# EAGLE design untitled (EAGLE 9.6.2)
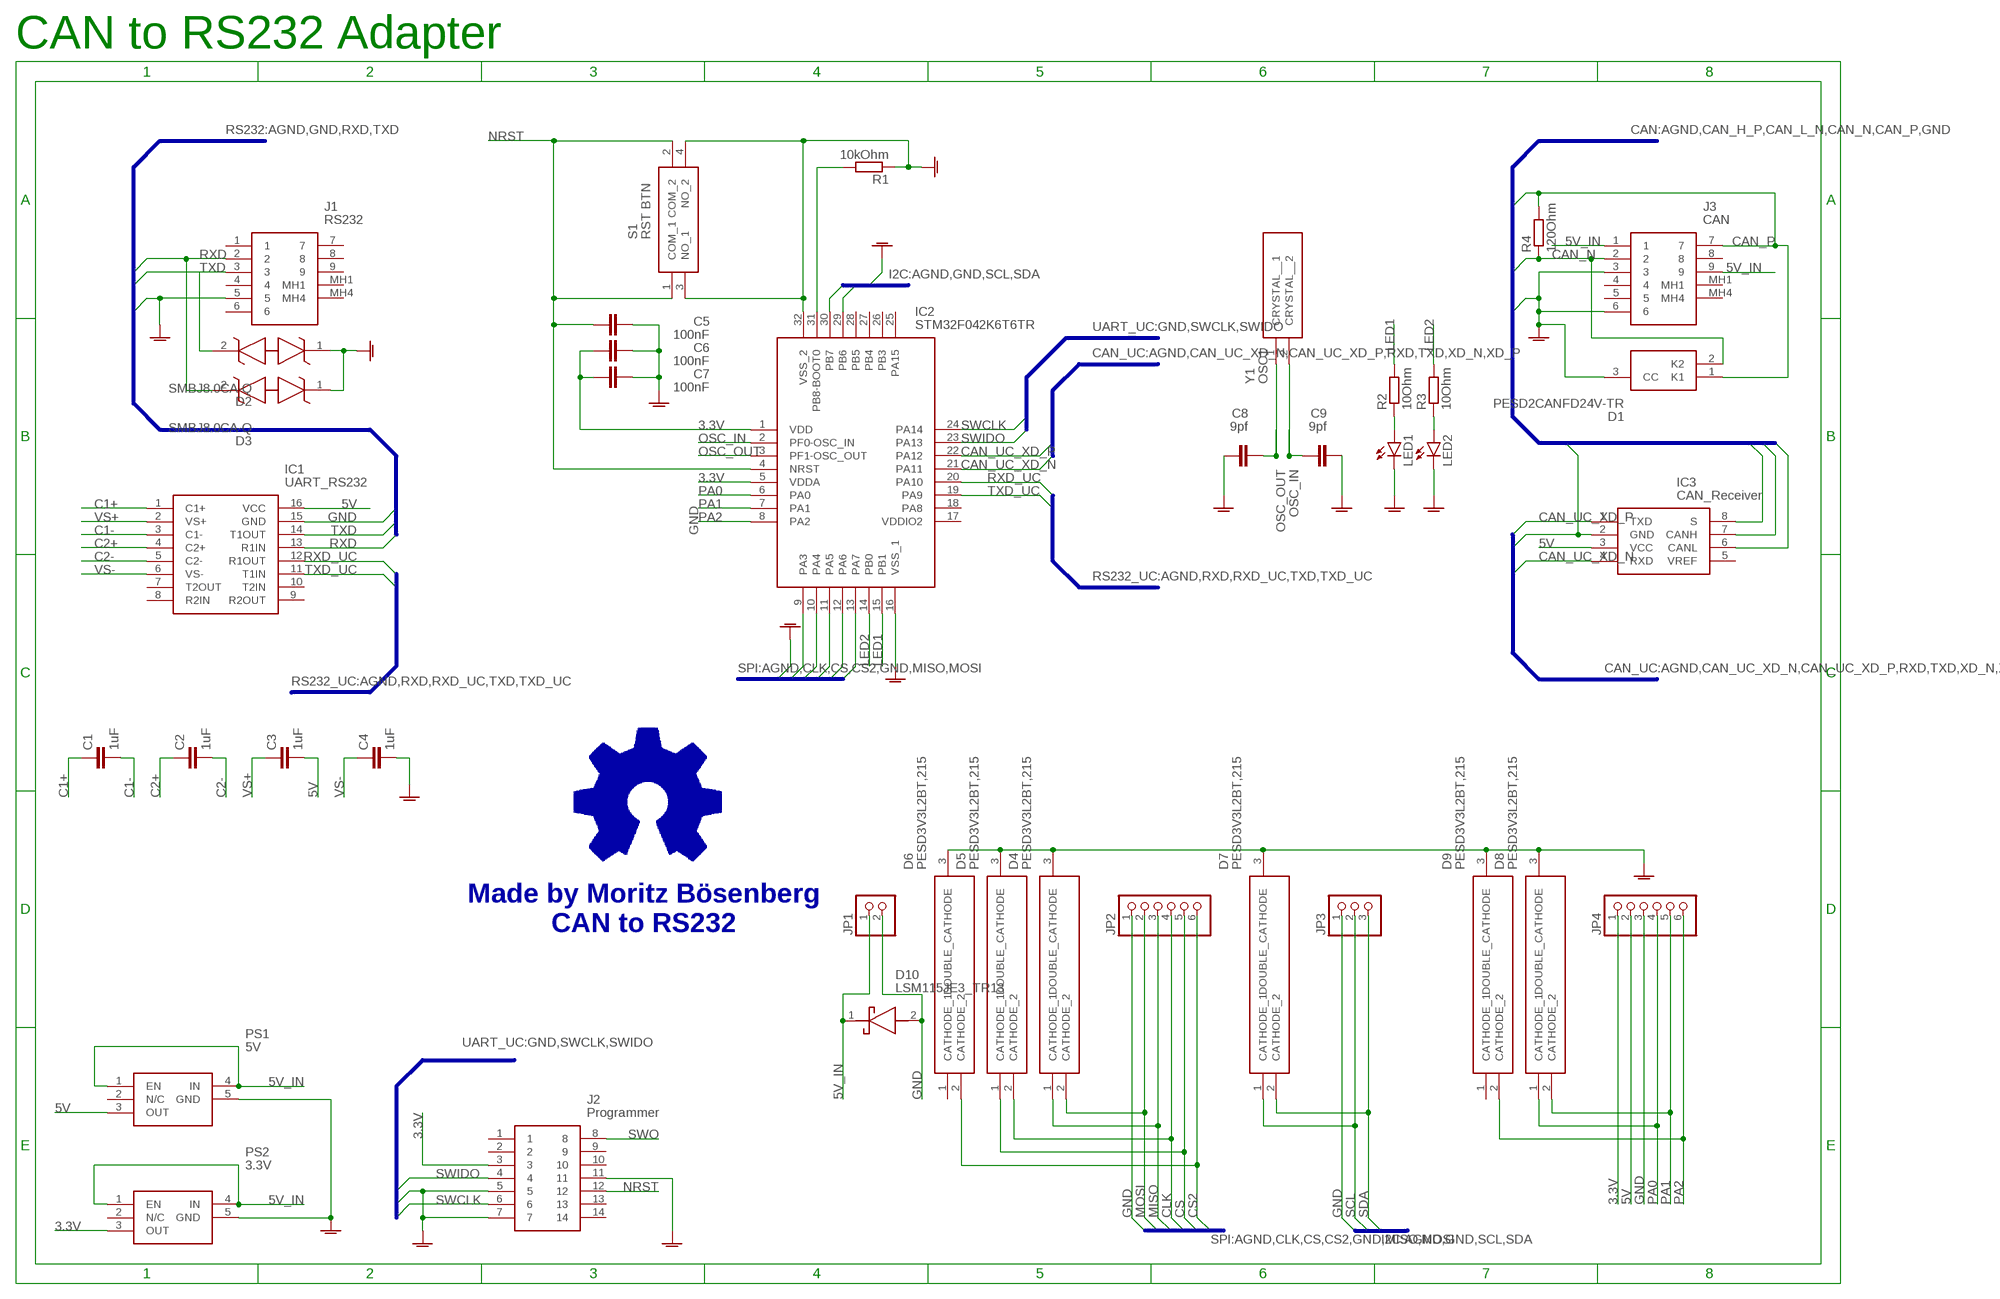
[diagram p0: schematic, sheet 1]

## Parts
C1  1uF  C-EU_805C0805  [C0805]
C2  1uF  C-EU_805C0805  [C0805]
C3  1uF  C-EU_805C0805  [C0805]
C4  1uF  C-EU_805C0805  [C0805]
C5  100nF  C-EU_805C0805  [C0805]
C6  100nF  C-EU_805C0805  [C0805]
C7  100nF  C-EU_805C0805  [C0805]
C8  9pf  C-EU_805C0805  [C0805]
C9  9pf  C-EU_805C0805  [C0805]
D1  PESD2CANFD24V-TR  [SOT95P230X110-3N]
D2  SMBJ8.0CA-Q  [DIONM5436X244N]
D3  SMBJ8.0CA-Q  [DIONM5436X244N]
D4  PESD3V3L2BT,215  [SOT95P230X110-3N]
D5  PESD3V3L2BT,215  [SOT95P230X110-3N]
D6  PESD3V3L2BT,215  [SOT95P230X110-3N]
D7  PESD3V3L2BT,215  [SOT95P230X110-3N]
D8  PESD3V3L2BT,215  [SOT95P230X110-3N]
D9  PESD3V3L2BT,215  [SOT95P230X110-3N]
D10  LSM115JE3_TR13  [DIOM5436X330N]
IC1  UART_RS232  MAX232DRG4  [SOIC127P600X175-16N]
IC2  STM32F042K6T6TR  [QFP80P900X900X160-32N]
IC3  CAN_Receiver  TJA1050T_CM,118  [SOIC127P600X175-8N]
J1  RS232  K202XHT-E9S-N  [K202XHTE9SN]
J2  Programmer  FTSH-107-01-L-DV-K-A  [FTSH10701LDVKA]
J3  CAN  K202XHT-E9S-N  [K202XHTE9SN]
JP1  PINHD-1X2  [1X02]
JP2  PINHD-1X6  [1X06]
JP3  PINHD-1X3  [1X03]
JP4  PINHD-1X6  [1X06]
LED1  LED_805SML0805  [SML0805]
LED2  LED_805SML0805  [SML0805]
PS1  5V  LP38693MPX-5.0_NOPB  [SOT150P700X160-5N]
PS2  3.3V  LP38693MPX-5.0_NOPB  [SOT150P700X160-5N]
R1  10kOhm  R-EU_805R0805  [R0805]
R2  10Ohm  R-EU_805R0805  [R0805]
R3  10Ohm  R-EU_805R0805  [R0805]
R4  120Ohm  R-EU_805R0805  [R0805]
S1  RST BTN  PTS526_SM15_SMTR2_LFS  [PTS526SM15SMTR2LFS]
Y1  OSC1  CM7V-T1A-32.768KHZ-7PF-100PPM-  [CM7VT1A32768KHZ7PF100PPMTAQC]

## Nets
3.3V: C6.1 C7.1 IC2.1(VDD) IC2.5(VDDA) J2.3 JP4.1 PS2.3(OUT)
5V: C3.2 IC1.16(VCC) IC3.3(VCC) JP4.2 PS1.3(OUT)
5V_IN: D10.1(K) J3.1 J3.9 JP1.1 PS1.1(EN) PS1.4(IN) PS2.1(EN) PS2.4(IN)
C1+: C1.1 IC1.1(C1+)
C1-: C1.2 IC1.3(C1-)
C2+: C2.1 IC1.4(C2+)
C2-: C2.2 IC1.5(C2-)
CAN_N [CAN]: D1.2(K2) IC3.6(CANL) J3.2 R4.1
CAN_P [CAN]: D1.1(K1) IC3.7(CANH) J3.7 R4.2
CAN_UC_XD_N [CAN_Uc]: IC2.21(PA11) IC3.4(RXD)
CAN_UC_XD_P [CAN_Uc]: IC2.22(PA12) IC3.1(TXD)
CLK: D5.2(CATHODE_2) IC2.11(PA5) JP2.4
CS: D5.1(CATHODE_1) IC2.10(PA4) JP2.5
CS2: D6.2(CATHODE_2) IC2.9(PA3) JP2.6
GND: C4.2 C5.2 C6.2 C7.2 C8.1 C9.2 D1.3(CC) D2.1 D3.1 D4.3(DOUBLE_CATHODE) D5.3(DOUBLE_CATHODE) D6.3(DOUBLE_CATHODE) D7.3(DOUBLE_CATHODE) D8.3(DOUBLE_CATHODE) D9.3(DOUBLE_CATHODE) D10.2(A) IC1.15(GND) IC2.16(VSS_1) IC2.32(VSS_2) IC3.2(GND) IC3.8(S) J1.5 J2.5 J2.7 J2.11 J3.3 J3.6 JP1.2 JP2.1 JP3.1 JP4.3 LED1.C LED2.C PS1.5(GND) PS2.5(GND) R1.1 S1.3(NO_1) S1.4(NO_2) ; supply symbol labelled GNDA
LED1 [LEDs]: IC2.15(PB1) R2.2
LED2 [LEDs]: IC2.14(PB0) R3.2
MISO: D4.1(CATHODE_1) IC2.12(PA6) JP2.3
MOSI: D4.2(CATHODE_2) IC2.13(PA7) JP2.2
N$1: LED1.A R2.1
N$2: LED2.A R3.1
N$3: IC2.31(PB8-BOOT0) R1.2
NRST: C5.1 IC2.4(NRST) J2.12 S1.1(COM_1) S1.2(COM_2)
OSC_IN: C9.1 IC2.2(PF0-OSC_IN) Y1.2(CRYSTAL__2)
OSC_OUT: C8.2 IC2.3(PF1-OSC_OUT) Y1.1(CRYSTAL__1)
PA0: D8.1(CATHODE_1) IC2.6(PA0) JP4.4
PA1: D8.2(CATHODE_2) IC2.7(PA1) JP4.5
PA2: D9.2(CATHODE_2) IC2.8(PA2) JP4.6
RXD [CAN_Uc]: D3.2 IC1.13(R1IN) J1.2
RXD_UC: IC1.12(R1OUT) IC2.20(PA10)
SCL: D7.1(CATHODE_1) IC2.29(PB6) JP3.2
SDA: D7.2(CATHODE_2) IC2.30(PB7) JP3.3
SWCLK: IC2.24(PA14) J2.6
SWIDO: IC2.23(PA13) J2.4
SWO: J2.8
TXD [CAN_Uc]: D2.2 IC1.14(T1OUT) J1.3
TXD_UC: IC1.11(T1IN) IC2.19(PA9)
VS+: C3.1 IC1.2(VS+)
VS-: C4.1 IC1.6(VS-)
Unconnected: D6.1(CATHODE_1) D9.1(CATHODE_1) IC1.7(T2OUT) IC1.8(R2IN) IC1.9(R2OUT) IC1.10(T2IN) IC2.17(VDDIO2) IC2.18(PA8) IC2.25(PA15) IC2.26(PB3) IC2.27(PB4) IC2.28(PB5) IC3.5(VREF) J1.1 J1.4 J1.6 J1.7 J1.8 J1.9 J1.MH1 J1.MH4 J2.1 J2.2 J2.9 J2.10 J2.13 J2.14 J3.4 J3.5 J3.8 J3.MH1 J3.MH4 PS1.2(N/C) PS2.2(N/C)

## Buses
UART_UC:GND,SWCLK,SWIDO
RS232:AGND,GND,RXD,TXD
CAN:AGND,CAN_H_P,CAN_L_N,CAN_N,CAN_P,GND
CAN_UC:AGND,CAN_UC_XD_N,CAN_UC_XD_P,RXD,TXD,XD_N,XD_P
RS232_UC:AGND,RXD,RXD_UC,TXD,TXD_UC
I2C:AGND,GND,SCL,SDA
SPI:AGND,CLK,CS,CS2,GND,MISO,MOSI

## Notes on the sheet
- CAN to RS232 Adapter
- Made by Moritz Bösenberg
  CAN to RS232

## Library data of the parts
C1-C9 = CommonParts:C-EU_805: CAPACITOR, European symbol; SPICEPREFIX: C
D1 = MouserUseful:PESD2CANFD24V-TR: ESD Suppressors / TVS Diodes DIODE ESD PROT Source: Datasheet <https://assets.nexperia.com/documents/data-sheet/PESD2CANFD24V-T.pdf>; DESCRIPTION: ESD Suppressors / TVS Diodes DIODE ESD PROT; HEIGHT: 1.1mm; MANUFACTURER_NAME: Nexperia; MANUFACTURER_PART_NUMBER: PESD2CANFD24V-TR; MOUSER_PART_NUMBER: 771-PESD2CANFD24V-TR; MOUSER_PRICE-STOCK: https://www.mouser.co.uk/ProductDetail/Nexperia/PESD2CANFD24V-TR?qs=xZ%2FP%252Ba9zWqbW0qDIUI%252BQ%2FA%3D%3D
D2 D3 = MouserUseful:SMBJ8.0CA-Q: SMBJ-Q Transient Voltage Suppressor Diode Series, Bi-Directional Source: Datasheet <https://www.bourns.com/docs/Product-Datasheets/SMBJ-Q.pdf>; DESCRIPTION: SMBJ-Q Transient Voltage Suppressor Diode Series, Bi-Directional; HEIGHT: 2.44mm; MANUFACTURER_NAME: Bourns; MANUFACTURER_PART_NUMBER: SMBJ8.0CA-Q; MOUSER_PART_NUMBER: 652-SMBJ8.0CA-Q; MOUSER_PRICE-STOCK: https://www.mouser.co.uk/ProductDetail/Bourns/SMBJ80CA-Q?qs=T94vaHKWudSI%2FQLr%252BYuXrw%3D%3D
D4-D9 = MouserUseful:PESD3V3L2BT,215: ESD Suppressors / TVS Diodes Source: Datasheet <https://assets.nexperia.com/documents/data-sheet/PESDXL2BT_SER.pdf>; DESCRIPTION: ESD Suppressors / TVS Diodes; HEIGHT: 1.1mm; MANUFACTURER_NAME: Nexperia; MANUFACTURER_PART_NUMBER: PESD3V3L2BT,215; MOUSER_PART_NUMBER: 771-PESD3V3L2BT-T/R; MOUSER_PRICE-STOCK: https://www.mouser.co.uk/ProductDetail/Nexperia/PESD3V3L2BT215?qs=LOCUfHb8d9sJv74jXvbOZw%3D%3D
D10 = CommonParts:LSM115JE3_TR13: Schottky Diodes & Rectifiers Schottky Source: Datasheet <https://componentsearchengine.com/Datasheets/1/LSM115JE3_TR13.pdf>; DESCRIPTION: Schottky Diodes & Rectifiers Schottky; HEIGHT: 3.3mm; MANUFACTURER_NAME: Microsemi Corporation; MANUFACTURER_PART_NUMBER: LSM115JE3/TR13; MOUSER_PART_NUMBER: 494-LSM115JE3/TR13; MOUSER_PRICE-STOCK: https://www.mouser.com/Search/Refine.aspx?Keyword=494-LSM115JE3%2FTR13
IC1 = MouserUseful:MAX232DRG4: RS-232 Interface IC Dual EIA-232 Driver/ Receiver Source: Datasheet <http://www.ti.com/general/docs/lit/getliterature.tsp?genericPartNumber=MAX232&fileType=pdf&HQS=ti-null-null-sf-df-pf-sep-wwe&DCM=yes>; DESCRIPTION: RS-232 Interface IC Dual EIA-232 Driver/ Receiver; HEIGHT: 1.75mm; MANUFACTURER_NAME: Texas Instruments; MANUFACTURER_PART_NUMBER: MAX232DRG4; MOUSER_PART_NUMBER: 595-MAX232DRG4; MOUSER_PRICE-STOCK: https://www.mouser.co.uk/ProductDetail/Texas-Instruments/MAX232DRG4?qs=tP77tliwutBAhcsawRpYug%3D%3D
IC2 = MouserUseful:STM32F042K6T6TR: ARM Microcontrollers - MCU Mainstream ARM Cortex-M0 USB line MCU with 32 Kbytes Flash, 48 MHz CPU, USB, CAN and CEC functions Source: Datasheet <https://www.st.com/en/microcontrollers-microprocessors/stm32f042k6.html>; DESCRIPTION: ARM Microcontrollers - MCU Mainstream ARM Cortex-M0 USB line MCU with 32 Kbytes Flash, 48 MHz CPU, USB, CAN and CEC functions; HEIGHT: 1.6mm; MANUFACTURER_NAME: STMicroelectronics; MANUFACTURER_PART_NUMBER: STM32F042K6T6TR; MOUSER_PART_NUMBER: 511-STM32F042K6T6TR; MOUSER_PRICE-STOCK: https://www.mouser.co.uk/ProductDetail/STMicroelectronics/STM32F042K6T6TR?qs=%252BEew9%252B0nqrBO2N6vhg3%252BsA%3D%3D
IC3 = MouserUseful:TJA1050T_CM,118: NXP - TJA1050T/CM,118 - CAN TRANSCEIVER, 1TX/RX, SOIC-8 Source: Datasheet <http://www.nxp.com/docs/en/data-sheet/TJA1050.pdf>; DESCRIPTION: NXP - TJA1050T/CM,118 - CAN TRANSCEIVER, 1TX/RX, SOIC-8; HEIGHT: 1.75mm; MANUFACTURER_NAME: NXP; MANUFACTURER_PART_NUMBER: TJA1050T/CM,118; MOUSER_PART_NUMBER: 771-TJA1050T/CM118; MOUSER_PRICE-STOCK: https://www.mouser.co.uk/ProductDetail/NXP-Semiconductors/TJA1050T-CM118?qs=5XOdhvmYM0NFFspw0VP5sA%3D%3D
J1 J3 = MouserUseful:K202XHT-E9S-N: D-Sub Standard Connectors Source: Datasheet; DESCRIPTION: D-Sub Standard Connectors; HEIGHT: 12.8mm; MANUFACTURER_NAME: Kycon; MANUFACTURER_PART_NUMBER: K202XHT-E9S-N; MOUSER_PART_NUMBER: 806-K202XHT-E9S-N; MOUSER_PRICE-STOCK: https://www.mouser.co.uk/ProductDetail/Kycon/K202XHT-E9S-N?qs=gotfk7Nc9iJUua3eLQY%2FyA%3D%3D
J2 = MouserUseful:FTSH-107-01-L-DV-K-A: Headers & Wire Housings .050" Micro Terminal Strip Source: Datasheet <http://suddendocs.samtec.com/prints/ftsh-1xx-xx-xxx-dv-xxx-xxx-mkt.pdf>; DESCRIPTION: Headers & Wire Housings .050" Micro Terminal Strip; HEIGHT: 5.97mm; MANUFACTURER_NAME: SAMTEC; MANUFACTURER_PART_NUMBER: FTSH-107-01-L-DV-K-A; MOUSER_PART_NUMBER: 200-FTSH10701LDVKA; MOUSER_PRICE-STOCK: https://www.mouser.co.uk/ProductDetail/Samtec/FTSH-107-01-L-DV-K-A?qs=PB6%2FjmICvI3xEHFou4PhNg%3D%3D
JP1 = pinhead:PINHD-1X2: PIN HEADER
JP2 JP4 = pinhead:PINHD-1X6: PIN HEADER
JP3 = pinhead:PINHD-1X3: PIN HEADER
LED1 LED2 = CommonParts:LED_805: LED OSRAM: - CHIPLED LG R971, LG N971, LY N971, LG Q971, LY Q971, LO R971, LY R971 LH N974, LH R974 LS Q976, LO Q976, LY Q976 LO Q996 - Hyper CHIPLED LW Q18S LB Q993, LB Q99A, LB R99A - SideLED LS A670, LO A670, LY A670, LG A670, LP A670 LB A673, LV A673, LT A673, LW A673 LH A674 LY A675 LS A676, LA A676, LO A676, LY A676, LW A676 LS A679, LY A679, LG A679 - Hyper Micro SIDELED® LS Y876, LA Y876, LO Y876, LY Y876 LT Y87S - SmartLED LW L88C, LW L88S LB L89C, LB L89S, LG L890 LS L89K, LO L89K, LY L89K LS L896, LA L896, LO L896, LY L896 - TOPLED LS T670, LO T670, LY T670, LG T670, LP T670 LSG T670, LSP T670, LSY T670, LOP T670, LYG T670 LG T671, LOG T671, LSG T671 LB T673, LV T673, LT T673, LW T673 LH T674 LS T676, LA T676, LO T676, LY T676, LB T676, LH T676, LSB T676, LW T676 LB T67C, LV T67C, LT T67C, LS T67K, LO T67K, LY T67K, LW E67C LS E67B, LA E67B, LO E67B, LY E67B, LB E67C, LV E67C, LT E67C LW T67C LS T679, LY T679, LG T679 LS T770, LO T770, LY T770, LG T770, LP T770 LB T773, LV T773, LT T773, LW T773 LH T774 LS E675, LA E675, LY E675, LS T675 LS T776, LA T776, LO T776, LY T776, LB T776 LHGB T686 LT T68C, LB T68C - Hyper Mini TOPLED® LB M676 - Mini TOPLED Santana® LG M470 LS M47K, LO M47K, LY M47K Source: http://www.osram.convergy.de LUXEON: - LUMILED® LXK2-PW12-R00, LXK2-PW12-S00, LXK2-PW14-U00, LXK2-PW14-V00 LXK2-PM12-R00, LXK2-PM12-S00, LXK2-PM14-U00 LXK2-PE12-Q00, LXK2-PE12-R00, LXK2-PE12-S00, LXK2-PE14-T00, LXK2-PE14-U00 LXK2-PB12-K00, LXK2-PB12-L00, LXK2-PB12-M00, LXK2-PB14-N00, LXK2-PB14-P00, LXK2-PB14-Q00 LXK2-PR12-L00, LXK2-PR12-M00, LXK2-PR14-Q00, LXK2-PR14-R00 LXK2-PD12-Q00, LXK2-PD12-R00, LXK2-PD12-S00 LXK2-PH12-R00, LXK2-PH12-S00 LXK2-PL12-P00, LXK2-PL12-Q00, LXK2-PL12-R00 Source: www.luxeon.com KINGBRIGHT: KA-3528ASYC Source: www.kingbright.com
PS1 PS2 = MouserUseful:LP38693MPX-5.0_NOPB: LDO Voltage Regulators 500mA Low Dropout CMOS Linear Regulators Stable with Ceramic Output Capacitors 5-SOT-223 -40 to 125 Source: Datasheet <http://www.ti.com/lit/ds/snvs321o/snvs321o.pdf>
R1-R4 = CommonParts:R-EU_805: RESISTOR, European symbol
S1 = MouserUseful:PTS526_SM15_SMTR2_LFS: Tactile Switches 50mA 12VDC, 5.2x5.2mm, 1.5mm H, 160gf, G leads, No ground pin, metal actuator Source: Datasheet; DESCRIPTION: Tactile Switches 50mA 12VDC, 5.2x5.2mm, 1.5mm H, 160gf, G leads, No ground pin, metal actuator; HEIGHT: 1.5mm; MANUFACTURER_NAME: C & K COMPONENTS; MANUFACTURER_PART_NUMBER: PTS526 SM15 SMTR2 LFS; MOUSER_PART_NUMBER: 611-PTS526SM15SMTR2L; MOUSER_PRICE-STOCK: https://www.mouser.co.uk/ProductDetail/CK/PTS526-SM15-SMTR2-LFS?qs=UXgszm6BlbENivbslIA%252B5g%3D%3D
Y1 = MouserUseful:CM7V-T1A-32.768KHZ-7PF-100PPM-: CRYSTAL 32.768KHZ 7.0PF SMD Source: Datasheet <https://www.microcrystal.com/fileadmin/Media/Products/32kHz/Datasheet/CM7V-T1A.pdf>; DESCRIPTION: CRYSTAL 32.768KHZ 7.0PF SMD; HEIGHT: 0.65mm; MANUFACTURER_NAME: Micro Crystal AG; MANUFACTURER_PART_NUMBER: CM7V-T1A-32.768KHZ-7PF-100PPM-TA-QC; MOUSER_PART_NUMBER: 428-202156-MG01; MOUSER_PRICE-STOCK: https://www.mouser.co.uk/ProductDetail/Micro-Crystal/CM7V-T1A-32768kHz-7pF-100PPM-TA-QC?qs=7bTaA%2FLYtSbEiBEFaseBIA%3D%3D

## Net classes
1 LEDs: width 0.152 mm

## Board
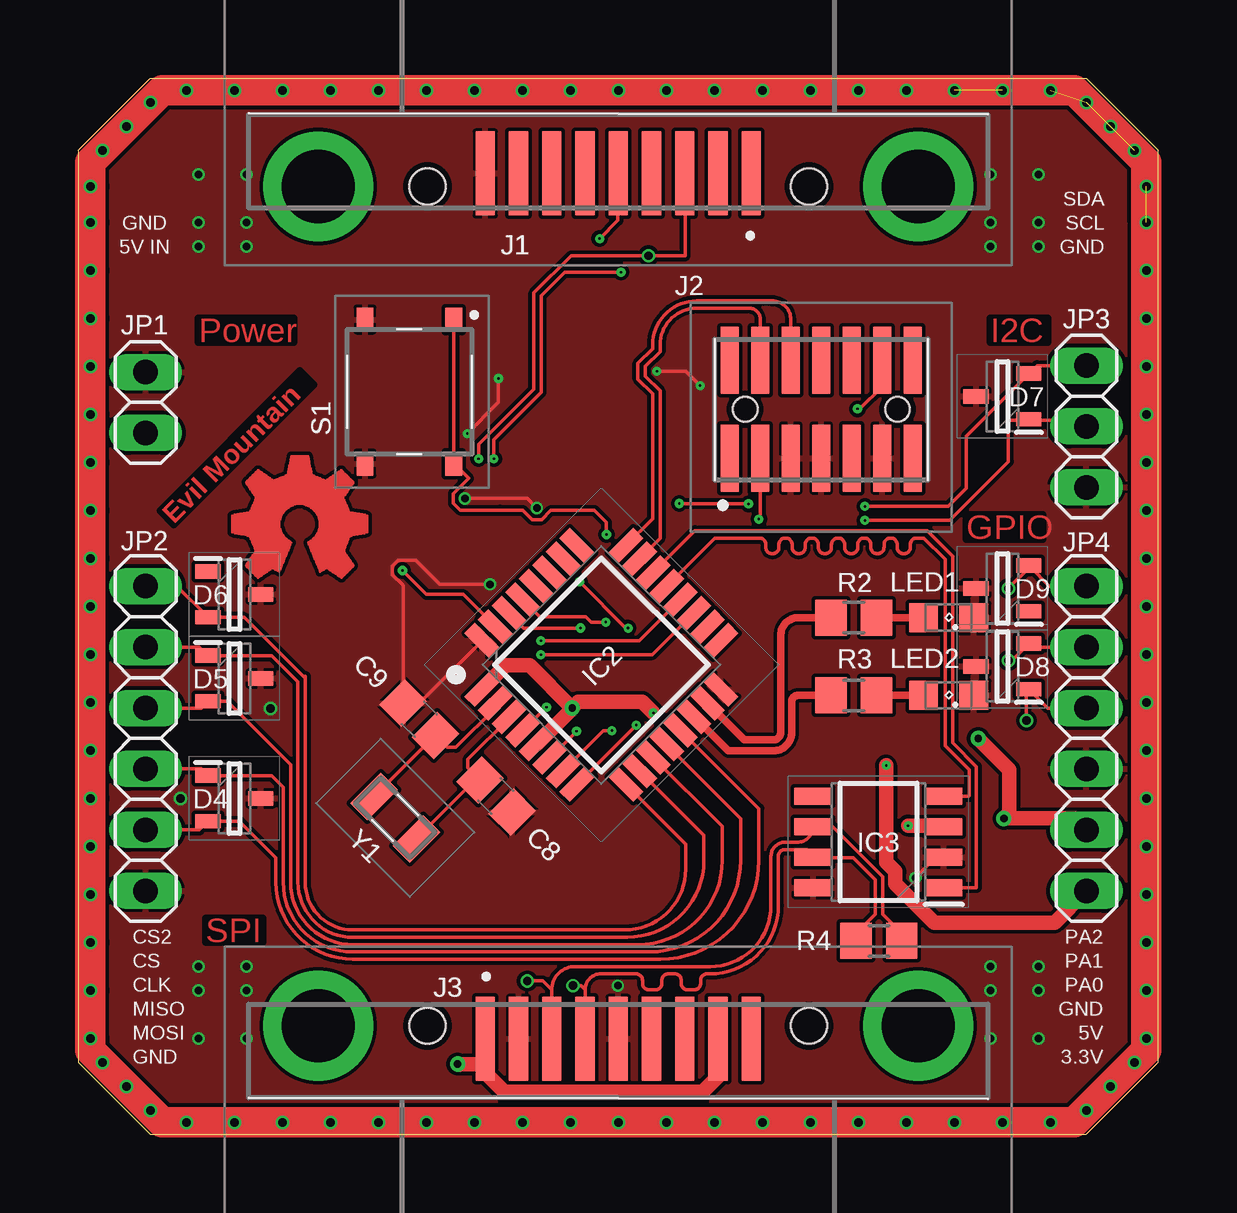
[diagram p1: board, top side]
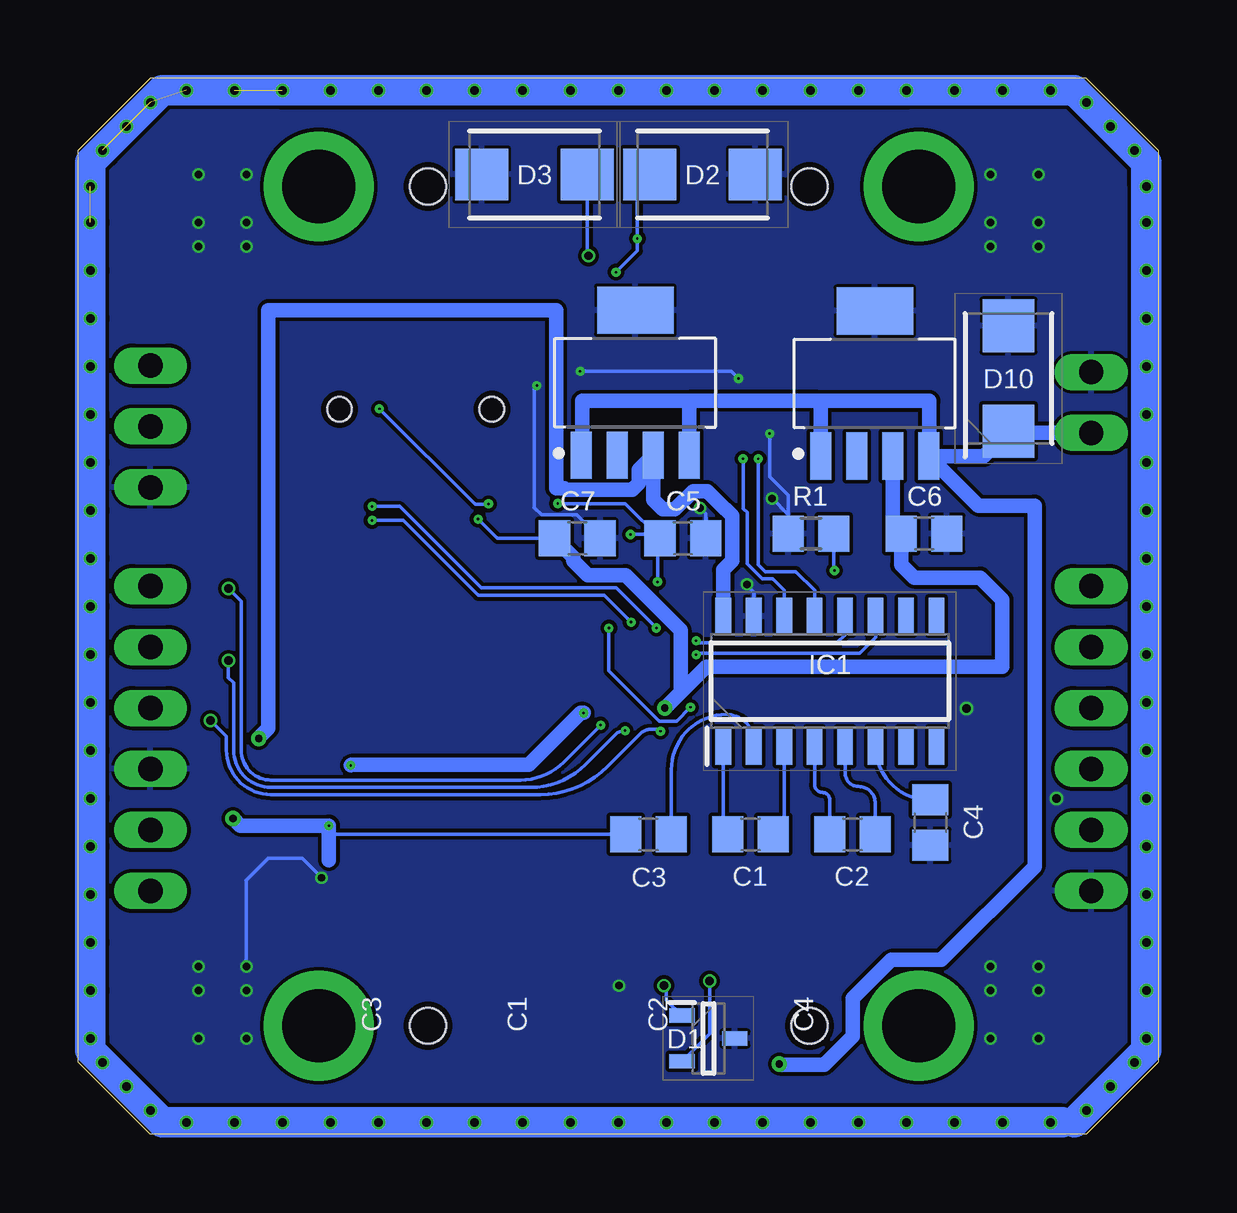
[diagram p2: board, bottom side, seen from below]

Size 45 x 44 mm. Coordinates in mm from the lower left corner, seen from the top.
Outline: 45,5.5 45,38.5
Outline: 0,3 3,0 42,0 45,3 45,41 42,44 3,44 0,41 0,3
Copper layers (1*16): Top 0.035mm / dielectric 1.5mm / Bottom 0.035mm
Design rules "default *": minimum track width 6mil, minimum drill 0.1mm, track to track 6mil, track to pad 6mil, pad to pad 6mil, via to via 6mil, smd to smd 6mil, copper to edge 10mil, drill to drill 6mil, minimum pad ring 10mil, minimum via ring 4mil, stop-mask expansion 4mil, vias tented up to drill 0mil, thermal gap 5mil

### Footprints (pad centres in the part's own frame; a part is rotated, then mirrored left to right if it is on the bottom)
C0805 = smd 1.3 x 1.5: 1 -0.95,0; 2 0.95,0
SOT95P230X110-3N = smd 1.05 x 0.6: 1 -1.1,0.95; 2 -1.1,-0.95; 3 1.1,0
DIONM5436X244N = smd 2.2 x 2.15: 1 -2.2,0; 2 2.2,0
DIOM5436X330N = smd 2.2 x 2.15: 1 -2.2,0; 2 2.2,0
SOIC127P600X175-16N = smd 1.525 x 0.65: 1 -2.712,4.445; 2 -2.712,3.175; 3 -2.712,1.905; 4 -2.712,0.635; 5 -2.712,-0.635; 6 -2.712,-1.905; 7 -2.712,-3.175; 8 -2.712,-4.445; 9 2.712,-4.445; 10 2.712,-3.175; 11 2.712,-1.905; 12 2.712,-0.635; 13 2.712,0.635; 14 2.712,1.905; 15 2.712,3.175; 16 2.712,4.445
QFP80P900X900X160-32N = smd 1.475 x 0.6: 1 -4.238,2.8; 2 -4.238,2; 3 -4.238,1.2; 4 -4.238,0.4; 5 -4.238,-0.4; 6 -4.238,-1.2; 7 -4.238,-2; 8 -4.238,-2.8; 17 4.238,-2.8; 18 4.238,-2; 19 4.238,-1.2; 20 4.238,-0.4; 21 4.238,0.4; 22 4.238,1.2; 23 4.238,2; 24 4.238,2.8 | smd 0.6 x 1.475: 9 -2.8,-4.238; 10 -2,-4.238; 11 -1.2,-4.238; 12 -0.4,-4.238; 13 0.4,-4.238; 14 1.2,-4.238; 15 2,-4.238; 16 2.8,-4.238; 25 2.8,4.238; 26 2,4.238; 27 1.2,4.238; 28 0.4,4.238; 29 -0.4,4.238; 30 -1.2,4.238; 31 -2,4.238; 32 -2.8,4.238
SOIC127P600X175-8N = smd 1.55 x 0.7: 1 -2.725,1.905; 2 -2.725,0.635; 3 -2.725,-0.635; 4 -2.725,-1.905; 5 2.725,-1.905; 6 2.725,-0.635; 7 2.725,0.635; 8 2.725,1.905
K202XHTE9SN = smd 0.8 x 3.5: 1 5.54,-0.5; 2 2.77,-0.5; 3 0,-0.5; 4 -2.77,-0.5; 5 -5.54,-0.5; 6 4.155,-0.5; 7 1.385,-0.5; 8 -1.385,-0.5; 9 -4.155,-0.5 | drill 3.05 pad 4.575: MH1 -12.495,-1.05; MH4 12.495,-1.05 | hole 1.5: -7.95,-1.05; 7.95,-1.05
FTSH10701LDVKA = smd 0.74 x 2.79: 1 -3.81,-2.035; 2 -3.81,2.035; 3 -2.54,-2.035; 4 -2.54,2.035; 5 -1.27,-2.035; 6 -1.27,2.035; 7 0,-2.035; 8 0,2.035; 9 1.27,-2.035; 10 1.27,2.035; 11 2.54,-2.035; 12 2.54,2.035; 13 3.81,-2.035; 14 3.81,2.035 | hole 1.02: -3.175,0; 3.175,0
1X02 = drill 1.016 long: 1 -1.27,0; 2 1.27,0
1X06 = drill 1.016 long: 1 -6.35,0; 2 -3.81,0; 3 -1.27,0; 4 1.27,0; 5 3.81,0; 6 6.35,0
1X03 = drill 1.016 long: 1 -2.54,0; 2 0,0; 3 2.54,0
SML0805 = smd 1.2 x 1.2: A 1.05,0; C -1.05,0
SOT150P700X160-5N = smd 1.965 x 0.889: 1 -3.023,2.25; 2 -3.023,0.75; 3 -3.023,-0.75; 4 -3.023,-2.25 | smd 1.965 x 3.189: 5 3.023,0
R0805 = smd 1.3 x 1.5: 1 -0.95,0; 2 0.95,0
PTS526SM15SMTR2LFS = smd 1 x 0.7: 1 -3,1.85; 2 3,1.85; 3 -3,-1.85; 4 3,-1.85
CM7VT1A32768KHZ7PF100PPMTAQC = smd 1 x 1.8: 1 -1.25,0; 2 1.25,0

### Placement (x,y rotation side)
C1  17,12.5 0 bottom
C2  12.75,12.5 0 bottom
C3  21.25,12.5 180 bottom
C4  9.5,13 270 bottom
C5  19.82,24.84 0 bottom
C6  9.77,25.04 0 bottom
C7  24.22,24.84 0 bottom
C8  17.4,14.1 135 top
C9  14.2,17.3 135 top
D1  18.75,4 0 bottom
D2  19,40 180 bottom
D3  26,40 0 bottom
D4  6.5,14 0 top
D5  6.5,19 0 top
D6  6.5,22.5 0 top
D7  38.5,30.75 180 top
D8  38.5,19.5 180 top
D9  38.5,22.75 180 top
D10  6.25,31.5 90 bottom
IC1  13.69,18.89 90 bottom
IC2  21.79,19.56 45 top
IC3  33.33,12.19 180 top
J1  22.49,40.55 0 top
J2  30.95,30.22 0 top
J3  22.49,3.48 180 top
JP1  2.8,30.5 90 top
JP2  2.8,16.5 90 top
JP3  42,29.5 90 top
JP4  42,16.5 90 top
LED1  36.26,21.53 180 top
LED2  36.26,18.3 180 top
PS1  21.8,31.32 90 bottom
PS2  11.82,31.29 90 bottom
R1  14.48,25.04 0 bottom
R2  32.3,21.53 180 top
R3  32.3,18.3 180 top
R4  33.35,8.07 180 top
S1  13.79,30.95 270 top
Y1  13.2,13.2 135 top

### Tracks (layer width: path | path; a pad name or v marks a point on that pad's centre or on a via)
3.3V  (via drill 0.1 pad 0.38, 0.3 pad 0.64)
  Top 0.152: J2.3 28.41,25.6 28.37,25.56 28.35,25.59 v28.35,25.64
  Top 0.61: v20.57,17.77 20.52,17.72 20.52,17.69 19.12,16.29 IC2.5 | v20.57,17.77 18.8,19.54 17.81,19.54 IC2.1 | v20.57,17.77 20.83,18.02 23.5,18.02 v23.95,17.56 | v33.66,15.38 33.66,11.34 34.04,10.96 34.04,10.45 35.66,8.83 40.68,8.83 JP4.1
  Bottom 0.152: v28.35,25.64 27.55,24.84 C7.1
  Bottom 0.61: PS2.3 11.07,25.39 C6.1 | C7.1 24.38,24.05 24.38,23.9 23.78,23.3 22.2,23.3 19.91,21.01 19.91,18.43 v20.57,17.77 18.85,19.49 6.5,19.49 6.5,22.29 7.42,23.2 10.19,23.2 10.72,23.74 C6.1 | v23.95,17.56 24.08,17.56 26.24,15.4 33.63,15.4 v33.66,15.38 | C6.1 10.67,24.99
5V  (via drill 0.1 pad 0.38, 0.3 pad 0.64)
  Top 0.61: v37.49,16.5 38.79,15.2 38.79,13.4 v38.56,13.17 41.52,13.17 JP4.2 | v34.57,12.86 36.01,12.86 IC3.3
  Bottom 0.152: C3.2 34.32,12.5 arc-90 34.57,12.25
  Bottom 0.61: IC1.16 18.14,23.53 17.76,23.9 17.76,25.78 18.03,26.05 18.04,26.05 18.8,26.81 19.39,26.81 20.16,26.05 20.65,26.05 21.05,26.45 PS1.3 21.65,27.7 21.65,27.12 21.92,26.86 24.68,26.86 24.76,26.94 25.09,26.94 25.09,34.35 37.08,34.35 37.08,16.93 37.5,16.51 v37.49,16.5 | v38.56,13.17 38.25,12.86 v34.57,12.86 34.57,12.25 34.57,11.43
5V_IN  (via drill 0.3 pad 0.64)
  Top 0.61: 15.88,2.91 15.82,2.91 v15.8,2.93 16.95,2.93 J3.1 16.94,2.57 17.75,1.77 26,1.77 26.65,2.42 J3.9
  Bottom 0.152: v15.8,2.93 15.77,2.91 | 6.18,29.23 6.32,29.23 | D10.1 6.18,29.23 | 6.18,29.23 6,29.23 5,29.23 4.25,29.23
  Bottom 0.61: 5,29.23 4.25,29.23 JP1.1 6,29.23 | PS2.4 7.28,28.27 6.32,29.23 | PS1.4 19.55,30.57 | 14.2,30.57 9.55,30.57 9.55,28.29 PS2.4 | PS2.1 14.07,30.44 14.2,30.57 | PS1.1 24.01,28.34 24.01,30.57 19.55,30.57 | 14.2,30.57 19.55,30.57 | PS2.4 7.5,26.2 5.16,26.2 5.16,11.16 9.04,7.28 11.13,7.28 12.74,5.67 12.74,4.09 13.92,2.91 15.77,2.91
C1+
  Bottom 0.152: IC1.1 18.14,12.69 arc-90 C1.1
C1-
  Bottom 0.152: IC1.3 15.6,12.96 arc90 C1.2
C2+
  Bottom 0.152: IC1.4 14.32,14.57 arc-90 14,14.25 arc90 13.7,13.95 C2.1
C2-
  Bottom 0.152: IC1.5 13.05,15.05 arc-90 12.5,14.5 arc90 11.8,13.8 C2.2
CAN_N  (via drill 0.35)
  Top 0.152: J3.2 19.72,6.04 | 19.72,6.04 arc-90 20.68,7 26.31,7 arc90 28.85,9.54 28.85,11.59 arc-90 29.44,12.18 29.96,12.18 arc90 IC3.6 31.42,12.82 33.5,10.74 33.5,9.17 34.3,8.37 R4.1 | v18.7,6.4 19.36,6.4 19.72,6.04
  Bottom 0.152: D1.2 18.7,4.2 v18.7,6.4
CAN_P  (via drill 0.35)
  Top 0.152: J3.7 21.11,6.04 | 21.11,6.04 arc-90 21.76,6.69 23.23,6.69 arc-90 23.5,6.42 23.5,6.29 arc90 23.77,6.03 24.04,6.03 arc90 24.31,6.29 24.31,6.42 arc-90 24.57,6.69 24.85,6.69 arc-90 25.11,6.42 25.11,6.29 arc90 25.38,6.03 25.65,6.03 arc90 25.92,6.29 25.92,6.42 arc-90 26.19,6.69 26.31,6.69 arc90 29.16,9.54 29.16,11.59 arc-90 29.44,11.87 30.28,11.87 arc-90 IC3.7 30.63,11.53 32.28,11.53 33.2,10.61 33.2,9.17 32.4,8.37 R4.2 | v20.6,6.2 20.94,6.2 21.11,6.04
  Bottom 0.152: D1.1 20.5,5.6 20.5,6.2 v20.6,6.2
CAN_UC_XD_N
  Top 0.152: IC2.21 26.51,24.85 28.37,24.85 arc-90 28.64,24.59 28.64,24.47 arc90 28.91,24.2 28.92,24.2 arc90 29.19,24.47 29.19,24.59 arc-90 29.45,24.85 29.47,24.85 arc-90 29.73,24.59 29.73,24.47 arc90 30,24.2 30.01,24.2 arc90 30.28,24.47 30.28,24.59 arc-90 30.55,24.85 30.56,24.85 arc-90 30.83,24.59 30.83,24.47 arc90 31.09,24.2 31.11,24.2 arc90 31.38,24.47 31.38,24.59 arc-90 31.64,24.85 31.66,24.85 arc-90 31.92,24.59 31.92,24.47 arc90 32.19,24.2 32.2,24.2 arc90 32.47,24.47 32.47,24.59 arc-90 32.74,24.85 32.75,24.85 arc-90 33.02,24.59 33.02,24.47 arc90 33.28,24.2 33.3,24.2 arc90 33.56,24.47 33.56,24.59 arc-90 33.83,24.85 33.84,24.85 arc-90 34.11,24.59 34.11,24.47 arc90 34.38,24.2 34.39,24.2 arc90 34.66,24.47 34.66,24.59 arc-90 34.92,24.85 35.23,24.85 36.12,23.96 36.12,16.19 37.11,15.2 37.11,14.11 37.09,14.09 IC3.4
CAN_UC_XD_P
  Top 0.152: IC2.22 25.69,25.16 35.36,25.16 36.42,24.09 36.42,16.32 37.41,15.33 37.41,10.28 IC3.1
CLK
  Top 0.152: IC2.11 26.82,12.84 26.82,11.42 arc-90 23.32,7.91 11.43,7.91 arc-90 8.84,10.5 8.84,14.5 8.84,14.62 8.84,15.41 6.2,18.05 D5.2 5.12,17.77 JP2.4
CS
  Top 0.152: IC2.10 26.06,12.47 26.06,11.42 arc-90 22.86,8.22 11.43,8.22 arc-90 9.14,10.5 9.14,18.86 8.05,19.95 D5.1 5.04,20.31 JP2.5
CS2
  Top 0.152: 9.45,19.09 9.45,19 | 9.45,19 9.45,10.5 arc90 11.43,8.52 22.76,8.52 arc90 25.3,11.06 25.3,12.1 IC2.9 | JP2.6 4.1,22.85 D6.2 6.9,21.55 9.45,19
GND  (via drill 0.1 pad 0.38, 0.3 pad 0.38, 0.35)
  Top 0.152: 30.5,10.18 IC3.8 | v34.87,10.7 35.73,11.55 IC3.2 | v25.9,31.2 25.3,31.8 v24.1,31.8 | v17.5,31.5 17.5,30.5 v16.2,29.2 | v19.1,26.1 18.7,26.5 v16.1,26.5 | v17.14,22.92 15.06,22.92 14.06,23.92 13.33,23.92 13.08,23.67 13.08,23.33 13.53,22.88 13.53,18.17 | 13.53,18.17 C9.2 | IC2.32 14.4,18.17 13.53,18.17
  Bottom 0.152: v38,7 38,10.6 37.1,11.5 35.67,11.5 v34.87,10.7 | C7.2 24.25,25.82 25.7,25.82 26,26.12 26,31.1 v25.9,31.2 | v24.1,31.8 17.8,31.8 v17.5,31.5 | v16.2,29.2 16.2,27.4 15.43,26.63 R1.1 15.43,25.83 v16.1,26.5 | C5.2 18.87,25.87 v19.1,26.1 | IC1.15 16.86,22.59 17.14,22.87 v17.14,22.92
  other vias: 5,7 7,7 7,6 5,6 5,4 7,4 38,6 38,4 40,4 40,6 40,7 38,40 38,38 40,38 38,37 40,37 40,40 7,40 7,38 5,40 5,38 5,37 7,37 22.47,6.2 8,17.75 4.25,14
  pour Top: -0.15,44.7 45.25,44.7 45.25,-0.25 -0.15,-0.25
  pour Bottom: -0.25,44.82 45.22,44.82 45.22,-0.25 -0.25,-0.25
LED1
  Top 0.305: R2.2 30,21.53 arc90 29.26,20.8 29.26,16.75 arc-90 28.96,16.45 27.75,16.45 IC2.15
LED2
  Top 0.305: R3.2 30,18.3 arc90 29.72,18.02 29.72,16.75 arc-90 28.96,15.99 27.06,15.99 IC2.14
MISO
  Top 0.152: IC2.12 24.5,16.23 27.58,13.15 27.58,11.42 arc-90 23.77,7.61 11.43,7.61 arc-90 8.53,10.5 8.53,14.47 8.05,14.95 D4.1 5.12,15.23 JP2.3
MOSI
  Top 0.152: IC2.13 28.35,13.57 28.35,11.42 arc-90 24.23,7.3 11.43,7.3 arc-90 8.23,10.5 8.23,11.52 6.7,13.05 D4.2 5.04,12.69 JP2.2
N$1
  Top 0.305: LED1.A R2.1
N$2
  Top 0.305: LED2.A R3.1
N$3  (via drill 0.1 pad 0.38)
  Top 0.152: 17.38,21.16 IC2.31 16.03,22.5 14.5,22.5 v13.5,23.5
  Bottom 0.152: 13.56,25.04 R1.2 13.53,23.53 v13.5,23.5
N$4  (via drill 0.35)  (5 unrouted)
  Top 1.27: v8.5,43.5 v10.5,43.5 v12.5,43.5 v14.5,43.5 v16.5,43.5 v18.5,43.5 v20.5,43.5 v22.5,43.5 v24.5,43.5 v26.5,43.5 v28.5,43.5 v30.5,43.5 v32.5,43.5 v34.5,43.5 v36.5,43.5 41.5,43.5 v44,41 44.5,40.5 v44.5,38 v44.5,36 v44.5,34 v44.5,32 v44.5,30 v44.5,28 v44.5,26 v44.5,24 v44.5,22 v44.5,20 v44.5,18 v44.5,16 v44.5,14 v44.5,12 v44.5,10 v44.5,8 v44.5,6 v44.5,4 44.5,3.5 v44,3 v43,2 v42,1 41.5,0.5 v40.5,0.5 v38.5,0.5 v36.5,0.5 v34.5,0.5 v32.5,0.5 v30.5,0.5 v28.5,0.5 v26.5,0.5 v24.5,0.5 v22.5,0.5 v20.5,0.5 v18.5,0.5 v16.5,0.5 v14.5,0.5 v12.5,0.5 v10.5,0.5 v8.5,0.5 v6.5,0.5 v4.5,0.5 3.5,0.5 v3,1 v2,2 v1,3 0.5,3.5 v0.5,4 v0.5,6 v0.5,8 v0.5,10 v0.5,12 v0.5,14 v0.5,16 v0.5,18 v0.5,20 v0.5,22 v0.5,24 v0.5,26 v0.5,28 v0.5,30 v0.5,32 v0.5,34 v0.5,36 v0.5,38 v0.5,39.5 0.5,40.5 3.5,43.5 v8.5,43.5
  Bottom 1.27: 4,0.5 v4.5,0.5 v6.5,0.5 v8.5,0.5 v10.5,0.5 v12.5,0.5 v14.5,0.5 v16.5,0.5 v18.5,0.5 v20.5,0.5 v22.5,0.5 v24.5,0.5 v26.5,0.5 v28.5,0.5 v30.5,0.5 v32.5,0.5 v34.5,0.5 v36.5,0.5 v38.5,0.5 v40.5,0.5 41.5,0.5 v42,1 | v42,1 v43,2 v44,3 | v44,3 44.5,3.5 v44.5,4 v44.5,6 v44.5,8 v44.5,10 v44.5,12 v44.5,14 v44.5,16 v44.5,18 v44.5,20 v44.5,22 v44.5,24 v44.5,26 v44.5,28 v44.5,30 v44.5,32 v44.5,34 v44.5,36 v44.5,38 44.5,40.5 v44,41 41.5,43.5 v36.5,43.5 v34.5,43.5 v32.5,43.5 v30.5,43.5 v28.5,43.5 v26.5,43.5 v24.5,43.5 v22.5,43.5 v20.5,43.5 v18.5,43.5 v16.5,43.5 v14.5,43.5 v12.5,43.5 v10.5,43.5 3.5,43.5 0.5,40.5 v0.5,39.5 v0.5,38 v0.5,36 v0.5,34 v0.5,32 v0.5,30 v0.5,28 v0.5,26 v0.5,24 v0.5,22 v0.5,20 v0.5,18 v0.5,16 v0.5,14 v0.5,12 v0.5,10 v0.5,8 v0.5,6 v0.5,4 0.5,3.5 v1,3 v2,2 v3,1 3.5,0.5 | v42,1 v44,3
  other vias: 44.5,39.5 43,42 42,43 40.5,43.5 38.5,43.5
N$5  (via drill 0.35)
  other vias: 2,42
N$6  (via drill 0.35)
  other vias: 4.5,43.5
N$7  (via drill 0.35)
  other vias: 3,43
N$8  (via drill 0.35)
  other vias: 6.5,43.5
N$9  (via drill 0.35)
  other vias: 1,41
NRST  (via drill 0.1 pad 0.38)
  Top 0.152: J2.12 33.49,31.16 32.56,30.24 v32.46,30.24 | v27.91,26.27 25.07,26.27 25.04,26.3 v25.03,26.29 | S1.1 S1.2 16.25,27.34 15.62,26.7 15.62,26.3 15.9,26.02 17.57,26.02 17.59,26 18.52,26 18.9,25.62 19.3,25.62 19.68,26 21.5,26 22,25.5 v22,25 | v20.88,23.02 20.89,23.02 22.81,21.1 v22.9,21.1 | v19.5,17.8 18.55,16.85 IC2.4
  Bottom 0.152: v32.46,30.24 28.47,26.25 27.94,26.25 v27.91,26.27 | v25.03,26.29 22.22,26.29 C5.1 | v22,25 20.93,25 C5.1 | C5.1 20.87,24.74 v20.87,23.03 v20.88,23.02 | v19.5,17.8 20.08,17.22 20.8,17.22 22.9,19.32 v22.9,21.1
OSC_IN
  Top 0.152: IC2.2 17.38,17.78 15.72,16.13 15.37,16.13 C9.1 Y1.2
OSC_OUT
  Top 0.152: IC2.3 17.95,17.34 16.23,15.63 16.23,15.27 C8.2 16.54,14.77 Y1.1
PA0  (via drill 0.1 pad 0.38, 0.35)
  Top 0.152: v20.75,16.8 19.69,15.74 arc-45 IC2.6 | v39.5,17.25 39.5,18.45 D8.1 40.38,17.77 JP4.4
  Bottom 0.152: v20.75,16.8 arc-45 20.75,16.88 21.18,16.88 arc-45 21.57,16.72 22.96,15.32 arc45 25.77,14.16 36.98,14.16 arc90 38.84,16.01 38.84,16.59 v39.5,17.25
PA1  (via drill 0.1 pad 0.38, 0.35)
  Top 0.152: v22.23,16.83 21.87,16.83 20.21,15.16 IC2.7 | JP4.5 39.74,20.31 D8.2 38.9,19.75 v38.75,19.75
  Bottom 0.152: v22.23,16.83 arc-45 22.33,16.83 22.56,16.73 23.87,15.42 arc45 26.17,14.46 36.98,14.46 arc90 38.53,16.01 38.53,18.82 38.75,19.04 v38.75,19.75
PA2  (via drill 0.1 pad 0.38, 0.35)
  Top 0.152: v23.24,17.05 IC2.8 arc-45 IC2.8 | JP4.6 40.45,22.85 39.65,23.65 | 39.65,23.65 D9.2 | v38.75,22.75 39.65,23.65
  Bottom 0.152: v23.24,17.05 24.78,15.51 arc45 26.58,14.77 36.98,14.77 arc90 38.23,16.01 38.23,22.23 v38.75,22.75
RXD  (via drill 0.1 pad 0.38, 0.35)
  Top 0.152: v16.68,28.16 16.68,28.75 18.97,31.05 18.97,35.06 20.52,36.61 v23.75,36.61 25.27,36.61 25.27,40.04 J1.2
  Bottom 0.152: IC1.13 14.32,22.67 15.11,23.46 16.38,23.46 16.68,23.75 v16.68,28.16 | D3.2 23.8,36.66 v23.75,36.61
RXD_UC  (via drill 0.1 pad 0.38)
  Top 0.152: v19.27,20.57 23.36,20.57 IC2.20
  Bottom 0.152: IC1.12 13.05,20.83 13.4,20.48 19.18,20.48 v19.27,20.57
SCL  (via drill 0.1 pad 0.38)
  Top 0.152: v32.77,25.59 36.3,25.59 38.75,28.04 38.75,29.75 39.65,29.75 | v21.97,21.35 21.36,21.35 21.13,21.58 19.21,21.58 IC2.29 | D7.1 39.65,29.75 | JP3.2 41.75,29.75 39.65,29.75
  Bottom 0.152: v21.97,21.35 23.09,22.46 28.35,22.46 31.47,25.59 v32.77,25.59
SDA  (via drill 0.1 pad 0.38)
  Top 0.152: v32.77,26.17 36.25,26.17 36.43,26.36 37,26.93 37,29.1 D7.2 39.94,32.04 JP3.3 | v20.92,21.1 20.85,21.1 20.83,21.09 18.55,21.09 17.95,21.69 IC2.30
  Bottom 0.152: v20.92,21.1 22.59,22.77 28.22,22.77 31.62,26.17 v32.77,26.17
SWCLK
  Top 0.152: J2.6 29.68,33.95 arc90 28.9,34.73 25.76,34.73 arc90 23.93,32.91 23.93,32.74 23.31,32.13 23.31,31.47 23.93,30.86 23.93,25.66 IC2.24
SWIDO
  Top 0.152: J2.4 28.41,33.95 arc90 27.94,34.43 25.76,34.43 arc90 24.23,32.91 24.23,32.61 23.62,32 23.62,31.6 24.23,30.99 24.23,24.84 IC2.23
TXD  (via drill 0.1 pad 0.38)
  Top 0.152: v17.31,28.16 17.31,28.95 19.28,30.92 19.28,34.94 20.27,35.93 v22.61,35.93 | v21.72,37.32 22.48,38.09 22.48,40.04 J1.3
  Bottom 0.152: IC1.14 15.6,22.67 16.08,23.15 16.51,23.15 17.14,23.79 17.14,25.92 17.31,26.08 v17.31,28.16 | v22.61,35.93 21.72,36.82 v21.72,37.32 21.72,39.48 D2.2
TXD_UC  (via drill 0.1 pad 0.38)
  Top 0.152: IC2.19 23.91,19.99 v19.27,19.99
  Bottom 0.152: IC1.11 11.79,20.71 12.45,20.05 19.2,20.05 v19.27,19.99
VS+
  Bottom 0.152: 16.86,15.47 IC1.2 16.86,16.36 arc-90 18,17.5 arc-90 20.3,15.2 C3.1
VS-
  Bottom 0.152: IC1.6 arc-90 9.56,13.95 C4.1
(copper drawn outside any net)
  shapes: Top area x369

### Text on the board
Top: Power | I2C | Evil Mountain | GPIO | SPI
tNames: SDA | GND | SCL | 5V IN | GND | CS2 | PA2 | CS | PA1 | CLK | PA0 | MISO | GND | MOSI | 5V | GND | 3.3V
tStop: Power | I2C | Evil Mountain | GPIO | SPI
_tNames: J1 | J2 | JP1 | JP3 | S1 | JP2 | JP4 | R2 | LED1 | IC2 | R3 | LED2 | C9 | Y1 | C8 | IC3 | R4 | J3
_bNames: C6 | R1 | C5 | C7 | IC1 | C4 | C2 | C1 | C3